# Altium schematic sheet Sheet1.SchDoc
size A; SheetNumber: 1; SheetTotal: 1
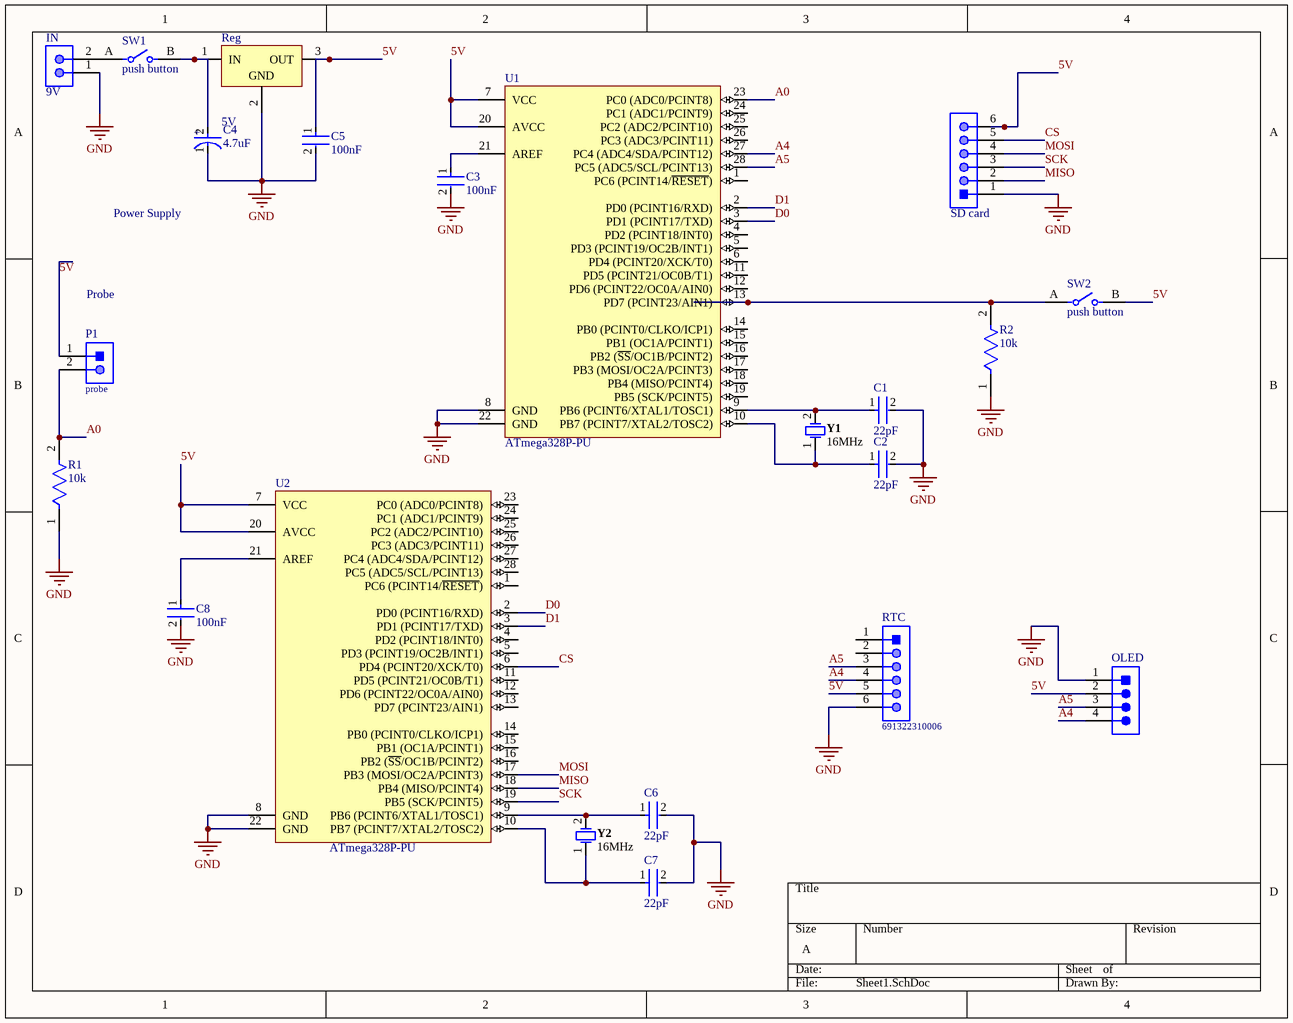
[diagram p0: Sheet1.SchDoc]

## Parts
C1  22pF  [FP-RCE0DB-MFG]
C2  22pF  [FP-RCE0DB-MFG]
C3  100nF  [FP-RCE0DB-MFG]
C4  4.7uF  [FP-RAD-TH-D_6_3_0_5-L_11-MFG]
C5  100nF  [FP-C322C104K5R5TA-MFG]
C6  22pF  [FP-RCE0DB-MFG]
C7  22pF  [FP-RCE0DB-MFG]
C8  100nF  [FP-RCE0DB-MFG]
IN  9V  [MOLX-22-27-2021_V]
OLED  6  [TECO-640456-4]  (value not drawn)
P1  probe  [620302124022]
R1  10k  [FP-CF18-MFG]
R2  10k  [FP-CF18-MFG]
Reg  5V  [TO220]
RTC  691322310006  [691322310006]
SD_card  66200611122  [66200611122]  (value not drawn)
SW1  push button  [FP-EVQ11Y04K-MFG]
SW2  push button  [FP-EVQ11Y04K-MFG]
U1  ATmega328P-PU  [28P3]
U2  ATmega328P-PU  [28P3]
Y1  16MHz  [FOX-FOXSLF160-20]
Y2  16MHz  [FOX-FOXSLF160-20]

## Nets
GND: C1.2 C2.2 C3.2 C4.1(C) C5.2 C6.2 C7.2 C8.2 IN.1 OLED.1 R1.1 R2.1 Reg.2(GND) RTC.6 SD_card.1 U1.8(GND) U1.22(GND) U2.8(GND) U2.22(GND)
5V: C5.1 OLED.2 P1.1 Reg.3(OUT) RTC.5 SD_card.6 SW2.B U1.7(VCC) U1.20(AVCC) U2.7(VCC) U2.20(AVCC)
A0: P1.2 R1.2 U1.23(PC0_(ADC0/PCINT8))
A4: OLED.4 RTC.4 U1.27(PC4_(ADC4/SDA/PCINT12))
A5: OLED.3 RTC.3 U1.28(PC5_(ADC5/SCL/PCINT13))
CS: SD_card.5 U2.6(PD4_(PCINT20/XCK/T0))
D0: U1.3(PD1_(PCINT17/TXD)) U2.2(PD0_(PCINT16/RXD))
D1: U1.2(PD0_(PCINT16/RXD)) U2.3(PD1_(PCINT17/TXD))
MISO: SD_card.2 U2.18(PB4_(MISO/PCINT4))
MOSI: SD_card.4 U2.17(PB3_(MOSI/OC2A/PCINT3))
SCK: SD_card.3 U2.19(PB5_(SCK/PCINT5))
NetC1_1: C1.1 U1.9(PB6_(PCINT6/XTAL1/TOSC1)) Y1.2
NetC2_1: C2.1 U1.10(PB7_(PCINT7/XTAL2/TOSC2)) Y1.1
NetC3_1: C3.1 U1.21(AREF)
NetC4_2: C4.2(A) Reg.1(IN) SW1.B
NetC6_1: C6.1 U2.9(PB6_(PCINT6/XTAL1/TOSC1)) Y2.2
NetC7_1: C7.1 U2.10(PB7_(PCINT7/XTAL2/TOSC2)) Y2.1
NetC8_1: C8.1 U2.21(AREF)
NetIN_2: IN.2 SW1.A
NetR2_2: R2.2 SW2.A U1.13(PD7_(PCINT23/AIN1))

Not connected (* = marked no-connect by the designer): RTC 1 2; U1 1(PC6_(PCINT14/~{RESET})) 4(PD2_(PCINT18/INT0)) 5(PD3_(PCINT19/OC2B/INT1)) 6(PD4_(PCINT20/XCK/T0)) 11(PD5_(PCINT21/OC0B/T1)) 12(PD6_(PCINT22/OC0A/AIN0)) 14(PB0_(PCINT0/CLKO/ICP1)) 15(PB1_(OC1A/PCINT1)) 16(PB2_(~{SS}/OC1B/PCINT2)) 17(PB3_(MOSI/OC2A/PCINT3)) 18(PB4_(MISO/PCINT4)) 19(PB5_(SCK/PCINT5)) 24(PC1_(ADC1/PCINT9)) 25(PC2_(ADC2/PCINT10)) 26(PC3_(ADC3/PCINT11)); U2 1(PC6_(PCINT14/~{RESET})) 4(PD2_(PCINT18/INT0)) 5(PD3_(PCINT19/OC2B/INT1)) 11(PD5_(PCINT21/OC0B/T1)) 12(PD6_(PCINT22/OC0A/AIN0)) 13(PD7_(PCINT23/AIN1)) 14(PB0_(PCINT0/CLKO/ICP1)) 15(PB1_(OC1A/PCINT1)) 16(PB2_(~{SS}/OC1B/PCINT2)) 23(PC0_(ADC0/PCINT8)) 24(PC1_(ADC1/PCINT9)) 25(PC2_(ADC2/PCINT10)) 26(PC3_(ADC3/PCINT11)) 27(PC4_(ADC4/SDA/PCINT12)) 28(PC5_(ADC5/SCL/PCINT13))

## Notes on the sheet
- Power Supply
- Probe
- (in symbol CMP-05427-000237-1) +

## Library data of the parts
C1 C2 C6 C7 = CMP-06035-047347-1: Cap Ceramic 22pF 100V C0G ±5% Radial 2.5mm +125°C Ammo Pack; Lead Diameter: 0.5mm; Lead/Base Style: Straight; Height: 3.5mm; Voltage: 100V; Mount: Through Hole; Min Operating Temperature: -55°C; Height - Seated (Max): 0.138inch; Dielectric: C0G; Width: 0.098inch; Depth: 2.5mm; Lead Pitch: 0.098inch; Packaging: Tape and Reel; Voltage Rating (DC): 100V; Capacitance: 22pF; Package Quantity: 2000; Max Operating Temperature: 125°C; Tolerance: 5%; Termination: Radial; Voltage Rating: 100V; Case/Package: Radial; Resistor Type: Ceramic; Length: 3.6mm; Ratings: AEC-Q200
C3 C8 = CMP-06035-045506-1: Cap Ceramic 4.7nF 100V X7R ±10% Radial 2.5mm +125°C Ammo Pack; Lead Diameter: 0.5mm; Lead/Base Style: Straight; Max Operating Temperature: 125°C; Ratings: AEC-Q200; Min Operating Temperature: -55°C; Resistor Type: Ceramic; Lead Pitch: 0.098inch; Packaging: Tape and Reel; Mount: Through Hole; Voltage Rating (DC): 100V; Termination: Radial; Width: 0.098inch; Dielectric: X7R; Voltage Rating: 100V; Height: 3.5mm; Case/Package: Radial; Length: 0.142inch; Package Quantity: 2000; Capacitance: 100nF; Tolerance: 10%; Height - Seated (Max): 0.138inch
C4 = CMP-05427-000237-1: Aluminum Electrolytic Capacitors (Radial Lead Type) 4.7uF ±20% 160V; Life (Hours): 2000Hour; Ripple Current: 43mA; Dielectric Material: Aluminium; Lead/Base Style: Straight; Lead Diameter: 0.5mm; Dissipation Factor: 0.15%; Height - Seated (Max): 0.48inch; Voltage: 160V; REACH SVHC: No SVHC; Package Quantity: 200; Length: 11.2mm; Termination: Radial; Weight: 0.01lb; Construction: RADIAL; Voltage Rating (DC): 160V; Number of Pins: 2; Voltage Rating: 160V; Min Operating Temperature: -25°C; Packaging: Bulk; Radiation Hardening: No; Series: NHG; Max Operating Temperature: 105°C; Height: 11.2mm; Mount: Through Hole; Tolerance: 20%; Capacitance: 4.7uF; Width: 0.25inch; Lead Pitch: 2.5mm; Diameter: 6.3mm; Ripple Current (AC): 43mA; Case/Package: Radial; Lead Free: Lead Free; RoHS Compliant: Yes
C5 = CMP-03020-034661-1: CAP CER 0.1UF 50V X7R RADIAL; Dielectric Material: Ceramic; Dissipation Factor: 2.5%; Lead Length: 7mm; Tolerance: 10%; Lead Diameter: 0.51mm; Lead/Base Style: Formed Leads; Capacitance: 100nF; Construction: RADIAL; RoHS Compliant: Yes; Voltage Rating (DC): 50V; Packaging: Bulk; Lead Free: Lead Free; Width: 0.125inch; Lead Pitch: 5.08mm; Voltage Rating: 50V; Number of Pins: 2; Radiation Hardening: No; Material: Ceramic; REACH SVHC: No SVHC; Height - Seated (Max): 0.26inch; Case/Package: Radial; Weight: 0.0625lb; Dielectric: X7R; Min Operating Temperature: -55°C; Voltage: 50V; Series: Golden Max™; Max Operating Temperature: 125°C; Height: 3.18mm; Termination: Radial; Length: 5.08mm; Depth: 3.18mm; Package Quantity: 500; Mount: Through Hole
IN = CMP-2000-05537-1: Male Header, Pitch 2.54 mm, 1 x 2 Position, Height 11.7 mm, Tail Length 3.56 mm, 0 to 75 degC, RoHS, Bulk; Manufacturer: Molex; PartNumber: 0022272021; Current rating: 4A; Package Version: Rev. BC, 02/2012; Voltage rating: 250V; No. of Positions: 2; Pitch: 2.54mm; No. of Rows: 1; Orientation: Vertical; Operating temperature: 0°Cto+75°C; Manufacturer URL: http://www.molex.com/; Mounting Technology: ThroughHole; Housing material: Nylon(UL94V-0); Package Description: 2-Leads Header, Body 5.08 x 5.8 mm, Pitch 2.54 mm; Voltage - Max: 250V; Datasheet URL: http://www.molex.com/pdm_docs/sd/022272021_sd.pdf; Package Reference: 22-27-2021; Contact material: Tinplatedbrass; Current - Max: 4A; Datasheet Version: Rev. F, 06/2009
OLED = CMP-2000-05419-1: Male Header, Pitch 2.54 mm, 1 x 4 Position, Height 10.03 mm, Tail Length 3.56 mm, RoHS, Bulk; Manufacturer: TE Connectivity; Material, Housing: Polyester; Primary Type: InterconnectSystem; Mount Angle: Vertical; Color, Housing: White; Current, Rating: 5 / A; Agency Approvals: CSA,UL; Contact Termination Area Plating: Tin; Temperature, Operating: -55to+105 / degC; Standards: RoHSCompliant,ELVCompliant,UL94V-0; Number of Positions: 4; Brand/Series: MTA-100Series; Angle: Straight; Pin Spacing: 0.1 / "; Material, Contact: CopperAlloy; Connector Type: MTA-100; Special Features: Pinstrip; Mounting Hole Size: 0.04 / "; Contact Centerline Spacing: 0.100 / in.; Voltage, Rating: 250 / V; Manufacturer URL: http://www.te.com/; Length, Pin: 0.14 / "; Length, Overall: 0.4 / "; Color: White; Flammability Rating: UL94V-0; Mounting Type: PCMount; Termination: Solder; Datasheet URL: https://datasheet.ciiva.com/16286/eng-ds-82056-mta-0608-16286228.pdf; Number of Contacts: 4; Contact Shape: Square; Contact Mating Area Plating: Tin; Length, Terminal Post: 0.14 / in.; Size, Post: 0.025 / in.; Contact Plating: Tin; Type: PCBPlug; Datasheet Version: Dec-14; Number of Rows: 1
P1 = CMP-1502-00660-1: Male Shrouded Header WR-WTB, SMT, Vertical, pitch 2 mm, 1 x 2 position; Manufacturer: Wurth Elektronik; Pitch: 2mm; Position: 1x2; Working Voltage: 100VAC; Contact Resistance: 20mOhm; Package Reference: 620302124022; Manufacturer URL: http://www.we-online.de; Gender: Male; Orientation: Vertical; Publisher: WurthElektronik; Mounting Technology: SMT; Operating Temperature: -25to85degC; Datasheet URL: https://katalog.we-online.de/em/datasheet/6203xx124022.pdf; Packaging: TapeandReel; Part Number: 620302124022
R1 R2 = CMP-26528-000002-1: RES 10K OHM 1/8W 5% CF AXIAL; Manufacturer Part Number: CF18JT10K0; Manufacturer: Stackpole Electronics; Power Rating: 0.125W; Temperature Coefficient: 0-500ppm/°C; Resistance: 10kΩ; Voltage Rating: 250V; Value: 10kΩ; Temperature: -55°C to +155°C; Height: 2mm; Lead Free: Yes; Automotive: No; Device Class L2: Resistors; Package: CF18; Series: CF; ComponentLink2Description: Datasheet; Ipc Land Pattern Name: RESAD656W65L360D200; Temperature Range High: +155°C; RoHS: TRUE; Device Class L3: Through-Hole Resistors; Temperature Range Low: -55°C; Device Class L1: Passive Components; Category: Res; Octopart: https://octopart.com/cf18jt10k0-stackpole+electronics-19205642; Composition: Carbon Film; Digikey Description: RES 10K OHM 1/8W 5% CF AXIAL; ComponentLink2URL: http://www.seielect.com/Catalog/SEI-CF_CFM.pdf; Tolerance: 5%
Reg = CMP-0244-00495-1: Positive Voltage Regulator, 6V, 3-Pin TO-220; PackageDescription: TO, Thru-Hole, Vertical, Heatsink Mounted; 3 In-Line Leads; Pitch 2.54 mm; ComponentLink3Description: Package Specification; PackageReference: TO220; PackageVersion: ver3.0; DatasheetVersion: 16/11/2011; ComponentLink3URL: http://www.st.com/internet/com/TECHNICAL_RESOURCES/TECHNICAL_LITERATURE/PACKAGE_INFORMATION/CD00004649.pdf; ComponentLink2Description: Datasheet; ComponentLink2URL: http://www.st.com/internet/com/TECHNICAL_RESOURCES/TECHNICAL_LITERATURE/DATASHEET/CD00000444.pdf; ComponentLink1Description: Manufacturer URL; ComponentLink1URL: http://www.st.com
RTC = CMP-1502-01890-1: Serie 322 - 3.81mm Horizontal PCB Header WR-TBL, 6 pin; Manufacturer: Wurth Elektronik; Pin Number: 6; Gender: Male; Pitch: 3.81mm; Package Reference: 691322310006; Manufacturer URL: http://www.we-online.de; Part Number: 691322310006; Datasheet URL: http://katalog.we-online.de/em/datasheet/6913223100xx.pdf; Publisher: WurthElektronik; Operating Temperature: -40to105degC; Packaging: Box; Mounting Technology: THT
SD_card = CMP-1502-00444-1: THT Male Header WR-MPC3, Vertical, Single Row, pitch 3 mm, 6 pins; Manufacturer: Wurth Elektronik; Working Voltage: 250VAC; Contact Resistance: 10mOhm; Pin Number: 6; Pitch: 3mm; Package Reference: 66200611122; Manufacturer URL: http://www.we-online.de; Packaging: Tube; Operating Temperature: -40to105degC; Publisher: WurthElektronik; Datasheet URL: https://katalog.we-online.de/em/datasheet/6620xx11122.pdf; Mounting Technology: THT; Gender: Male; Part Number: 66200611122; Orientation: Vertical
SW1 SW2 = CMP-05618-000106-1: SWITCH TACTILE SPST-NO 0.02A 15V; Operating Force: 1.6N; Actuator Type: Standard; Actuator Length: 0.4mm; Actuator Color: Black; Mechanical Life: 1000000Cycles; Switch Function: Off-Mom; Contact Resistance: 50mR; Switch Travel: 0.25mm; Throw Configuration: SPST; Illumination Type: Non-Illuminated; Package Quantity: 1; Max Operating Temperature: 70°C; Case/Package: Radial; Radiation Hardening: No; Packaging: Tape and Reel; Termination: PC Pin; Orientation: Straight; Min Operating Temperature: -20°C; Lead Free: Lead Free; Electrical Life: 1000000Cycles; RoHS Compliant: Yes; Max Voltage Rating (DC): 15V; Mount: Through Hole; Series: EVQ11; Size: 6mm
U1 U2 = CMP-0095-00013-2: 8-bit AVR Microcontroller, 32KB Flash, 1KB EEPROM, 2KB SRAM, 28-pin PDIP, Industrial Grade (-40°C to 85°C); RevisionNote: DatasheetVersion updated. URLs added.; PackageVersion: revB, Sep-2001; PackageDescription: 28-lead (0.300"/7.62mm Wide) Plastic Dual Inline Package (PDIP); DatasheetVersion: revD, May-2011; ComponentLink1Description: Manufacturer URL; ComponentLink1URL: http://www.atmel.com/; PackageReference: 28P3; ComponentLink2Description: ATmega48A/48PA/88A/88PA/168A/168PA/328/328P Datasheet; ComponentLink3URL: http://www.atmel.com/dyn/resources/prod_documents/8271S.pdf; ComponentLink2URL: http://www.atmel.com/dyn/resources/prod_documents/8271.pdf; ComponentLink3Description: ATmega48A/48PA/88A/88PA/168A/168PA/328/328P Summary
Y1 Y2 = CMP-1749-00003-1: Resistance Weld Thru-Hole Crystal, 16 MHz, -20 to 70 degC, 2-Pin THD, RoHS, Bulk; Voltage Rating: 250 V; Tolerance: 1%; Resistance: 221 kohm; Case\Package: Axial; Power Rating: 250 mW; RoHSCompliant: true; Package Quantity: 200; Packaging: Bulk; Min Operating Temperature: -55 degC; DatasheetVersion: Mar-15; ComponentLink1URL: http://www.foxonline.com/; Max Operating Temperature: 155 degC; PackageReference: FOXSLF160-20; Mount: Through Hole; PackageDescription: 2-Pin Through Hole Device, Body 11.35 x 4.65 mm; ComponentLink1Description: Manufacturer URL; ComponentLink2URL: http://www.foxonline.com/pdfs/hc49slf.pdf; ComponentLink2Description: Datasheet; Length: 0.248 inch